# Altium schematic sheet Hydrogen_Sensor.SchDoc
size A; SheetNumber: 9; SheetTotal: 12
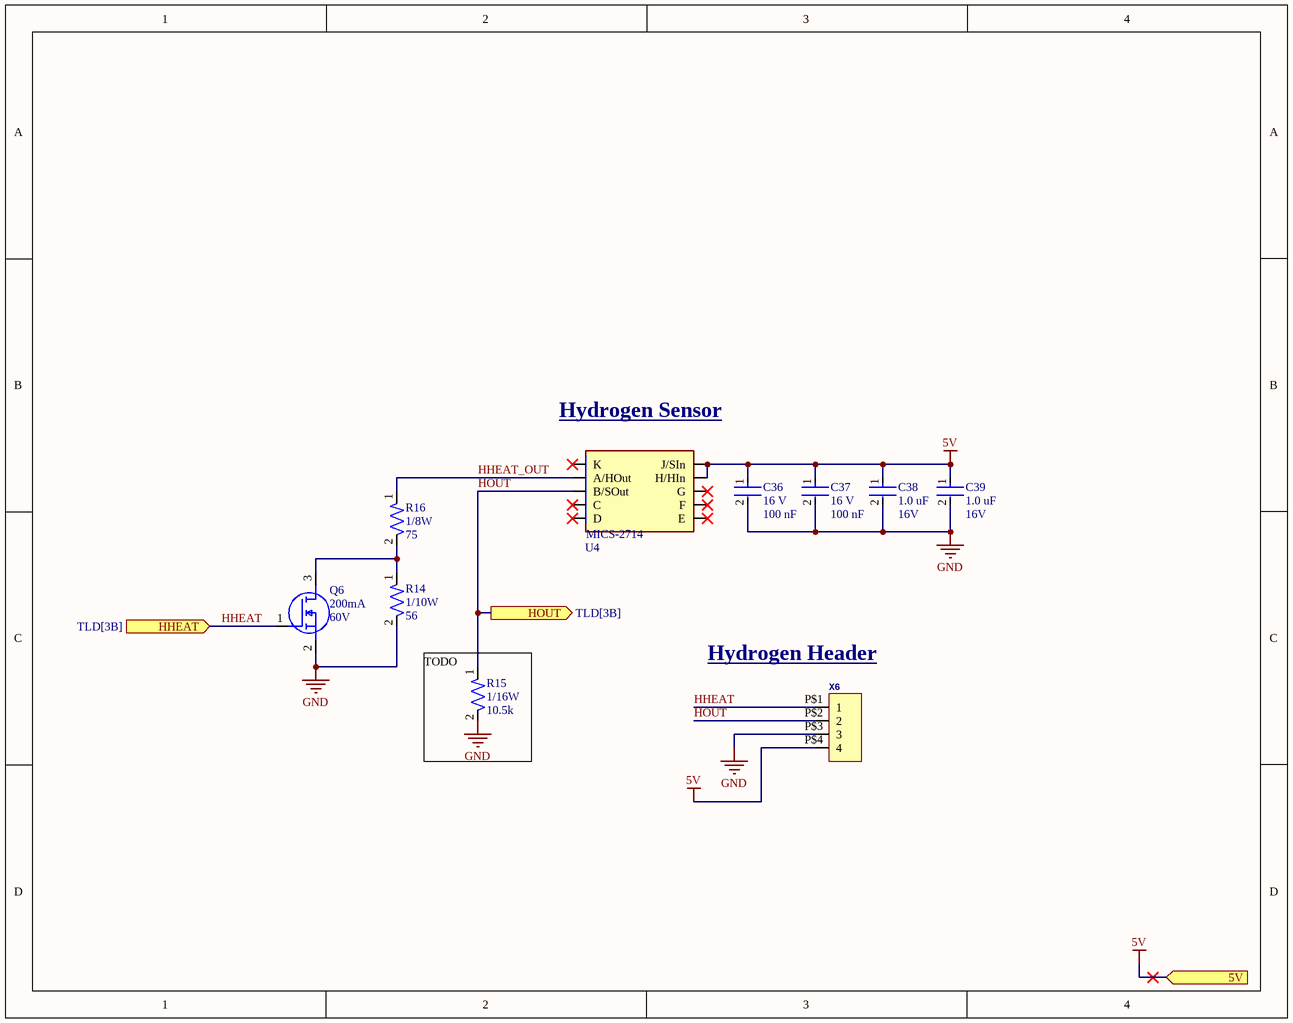
[diagram p0: Hydrogen_Sensor.SchDoc]

## Parts
C36  Voltage Rating: 16 V  Capacitance: 100 nF  [CAP-0402]  (hidden comment: CC0402KRX7R7BB104)
C37  Voltage Rating: 16 V  Capacitance: 100 nF  [CAP-0402]  (hidden comment: CC0402KRX7R7BB104)
C38  Capacitance: 1.0 uF  Voltage: 16V  [CAP-0603]  (hidden comment: CC0603KRX7R7BB105)
C39  Capacitance: 1.0 uF  Voltage: 16V  [CAP-0603]  (hidden comment: CC0603KRX7R7BB105)
Q6  Id-Continuous: 200mA  VDS-Max: 60V  [NMOS-SOT23-3]  (hidden comment: T2N7002AK,LM)
R14  Power: 1/10W  Resistance: 56  [RC0603N_YAG]  (hidden comment: RC0603FR-0756RL)
R15  Power: 1/16W  Resistance: 10.5k  [RES-0402]  (hidden comment: RC0402FR-0710K5L)
R16  Power: 1/8W  Resistance: 75  [RESC1508X50N]  (hidden comment: CRCW060375R0FKEA)
U4  MICS-2714  [MICS-SMD10]  (value not drawn)
X6  Molex - Micro-Fit 3.0 Series connector,  3.00mm (0.118") pitch header, 4 positions.  [43045-0400]  (value not drawn)

## Ports
5V (in), HHEAT (in, see TLD[3B]), HOUT (out, see TLD[3B])

## Nets
5V: C36.1 C37.1 C38.1 C39.1 U4.H(H/HIn) U4.J(J/SIn) X6.P$4(4) ; port 5V
GND: C36.2 C37.2 C38.2 C39.2 Q6.2(S) R14.2 R15.2 X6.P$3(3)
HHEAT: Q6.1(G) X6.P$1(1) ; port HHEAT
HHEAT_OUT: R16.1 U4.A(A/HOut)
HOUT: R15.1 U4.B(B/SOut) X6.P$2(2) ; port HOUT
NetQ6_3: Q6.3(D) R14.1 R16.2

Not connected (* = marked no-connect by the designer): U4 C* D* E* F* G* K*

## Notes on the sheet
- (near U4) Hydrogen Sensor
- (near X6) Hydrogen Header
- (near R15) TODO

## Library data of the parts
C36 C37 = CAP-0.1U-0001: CAP CER 0.1UF 16V X7R 0402; ComponentLink2Description: Datasheet; ComponentLink2URL: https://www.yageo.com/upload/media/product/productsearch/datasheet/mlcc/UPY-GPHC_X7R_6.3V-to-250V_24.pdf; Device Class: Ceramic; Size: 0402
C38 C39 = CAP-1U-0002: CAP CER 1UF 16V X7R 0603; Device Class: Ceramic; Size: 0603
Q6 = NMOS-200MA-0001: MOSFET N-CH 60V 200MA SOT23; Manufacturer: Toshiba; FET type: N-Channel; Rds On-Max: 3.9Ohm; Vgs-Max: 20V; Assembled?: no; Manufacturer Part Number: T2N7002AK,LM; Package: SOT-23-3
R14 = RES-56-0001: 56 Ohms ±1% 0.1W, 1/10W Chip Resistor 0603 (1608 Metric) Moisture Resistant Thick Film; Manufacturer_Name: Yageo; Copyright: Copyright (C) 2025 Ultra Librarian. All rights reserved.; Manufacturer_Part_Number: RC0603FR-0756RL; ComponentLink1Description: Datasheet; ComponentLink1URL: https://www.yageogroup.com/content/datasheet/asset/file/PYU-RC_GROUP_51_ROHS_L
R15 = RES-10.5k-0001: RES 10.5K OHM 1% 1/16W 0402; Tolerance: 1%; Size: 0402; ComponentLink1Description: Datasheet; ComponentLink1URL: https://www.yageo.com/upload/media/product/products/datasheet/rchip/PYu-RC_Group_51_RoHS_L_12.pdf
R16 = RES-75-0001: 75 Ohms Â±1% 0.1W, 1/10W Chip Resistor 0603 _1608 Metric_ Automotive AEC-Q200 Thick Film; MF: Vishay Dale; MP: CRCW060375R0FKEA; Digi-Key_Purchase_URL: https://www.digikey.pk/product-detail/en/vishay-dale/CRCW060375R0FKEA/541-75.0HCT-ND/1179681?utm_source=snapeda&utm_medium=aggregator&utm_campaign=symbol; SnapEDA_Link: https://www.snapeda.com/parts/CRCW060375R0FKEA/Vishay%20Dale/view-part/214661/?ref=snap; Value: *; Package: 1508 Vishay; Digi-Key_Part_Number: 541-75.0HCT-ND; ComponentLink1Description: Datasheet; ComponentLink1URL: https://www.vishay.com/docs/20035/dcrcwe3.pdf
U4 = IC-Hydrogen: MiCS-2714 Nitrogen Dioxide (NO2) Sensor mikroBUSâ„¢ Clickâ„¢ Platform Evaluation Expansion Board; MF: SGX Sensortech; SnapEDA_Link: https://www.snapeda.com/parts/MICS-2714/SGX+Sensortech/view-part/?ref=snap; Package: None; Value: *; MP: MICS-2714; Check_prices: https://www.snapeda.com/parts/MICS-2714/SGX+Sensortech/view-part/?ref=eda; ComponentLink1Description: Hydrogen Sensor Datasheet; ComponentLink1URL: https://www.sgxsensortech.com/content/uploads/2014/08/1107_Datasheet-MiCS-2714.pdf
X6 = HEADER_POS4_?43045-0401: GateName_1: G$1; SymbolName_1: HEADER_POS4; DeviceName: 43045-0401; LibraryName: con-molex-micro-fit-3_0_2; DeviceSetName: HEADER_POS4_?; Package: 43045-0400